# Altium schematic sheet ZIF_WRP.SchDoc
size B; DocumentNumber: 9; SheetNumber: 9; SheetTotal: 13
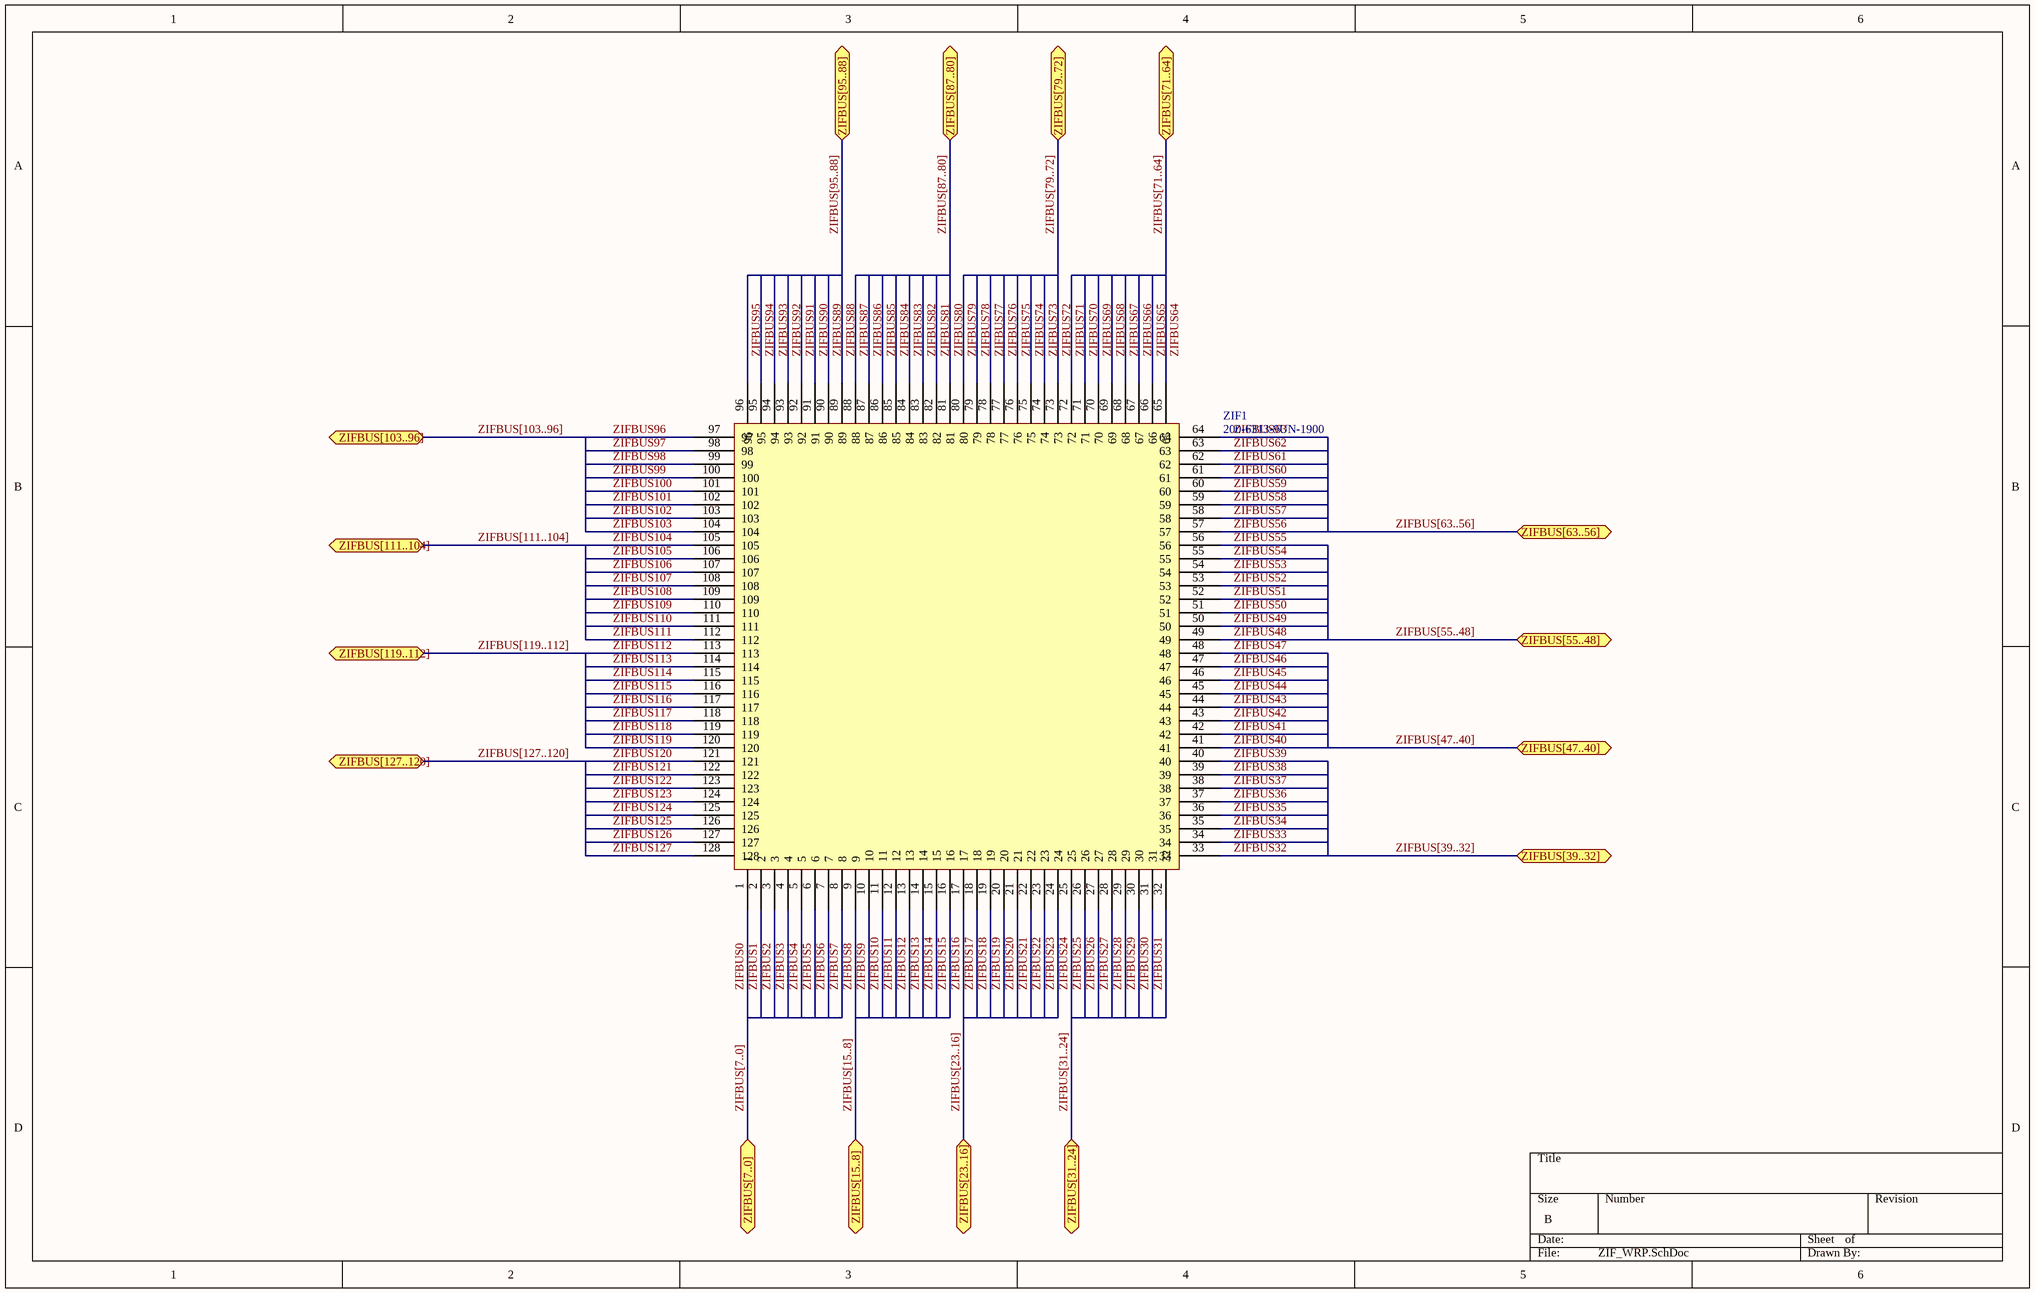
[diagram p0: ZIF_WRP.SchDoc]

## Parts
ZIF1  200-6313-9UN-1900  [ZIF_13x13]

## Ports
ZIFBUS[7..0], ZIFBUS[15..8], ZIFBUS[23..16], ZIFBUS[31..24], ZIFBUS[39..32], ZIFBUS[47..40], ZIFBUS[55..48], ZIFBUS[63..56], ZIFBUS[71..64], ZIFBUS[79..72], ZIFBUS[87..80], ZIFBUS[95..88], ZIFBUS[103..96], ZIFBUS[111..104], ZIFBUS[119..112], ZIFBUS[127..120]

## Nets
ZIFBUS0: ZIF1.1
ZIFBUS1: ZIF1.2
ZIFBUS2: ZIF1.3
ZIFBUS3: ZIF1.4
ZIFBUS4: ZIF1.5
ZIFBUS5: ZIF1.6
ZIFBUS6: ZIF1.7
ZIFBUS7: ZIF1.8
ZIFBUS8: ZIF1.9
ZIFBUS9: ZIF1.10
ZIFBUS10: ZIF1.11
ZIFBUS11: ZIF1.12
ZIFBUS12: ZIF1.13
ZIFBUS13: ZIF1.14
ZIFBUS14: ZIF1.15
ZIFBUS15: ZIF1.16
ZIFBUS16: ZIF1.17
ZIFBUS17: ZIF1.18
ZIFBUS18: ZIF1.19
ZIFBUS19: ZIF1.20
ZIFBUS20: ZIF1.21
ZIFBUS21: ZIF1.22
ZIFBUS22: ZIF1.23
ZIFBUS23: ZIF1.24
ZIFBUS24: ZIF1.25
ZIFBUS25: ZIF1.26
ZIFBUS26: ZIF1.27
ZIFBUS27: ZIF1.28
ZIFBUS28: ZIF1.29
ZIFBUS29: ZIF1.30
ZIFBUS30: ZIF1.31
ZIFBUS31: ZIF1.32
ZIFBUS32: ZIF1.33
ZIFBUS33: ZIF1.34
ZIFBUS34: ZIF1.35
ZIFBUS35: ZIF1.36
ZIFBUS36: ZIF1.37
ZIFBUS37: ZIF1.38
ZIFBUS38: ZIF1.39
ZIFBUS39: ZIF1.40
ZIFBUS40: ZIF1.41
ZIFBUS41: ZIF1.42
ZIFBUS42: ZIF1.43
ZIFBUS43: ZIF1.44
ZIFBUS44: ZIF1.45
ZIFBUS45: ZIF1.46
ZIFBUS46: ZIF1.47
ZIFBUS47: ZIF1.48
ZIFBUS48: ZIF1.49
ZIFBUS49: ZIF1.50
ZIFBUS50: ZIF1.51
ZIFBUS51: ZIF1.52
ZIFBUS52: ZIF1.53
ZIFBUS53: ZIF1.54
ZIFBUS54: ZIF1.55
ZIFBUS55: ZIF1.56
ZIFBUS56: ZIF1.57
ZIFBUS57: ZIF1.58
ZIFBUS58: ZIF1.59
ZIFBUS59: ZIF1.60
ZIFBUS60: ZIF1.61
ZIFBUS61: ZIF1.62
ZIFBUS62: ZIF1.63
ZIFBUS63: ZIF1.64
ZIFBUS64: ZIF1.65
ZIFBUS65: ZIF1.66
ZIFBUS66: ZIF1.67
ZIFBUS67: ZIF1.68
ZIFBUS68: ZIF1.69
ZIFBUS69: ZIF1.70
ZIFBUS70: ZIF1.71
ZIFBUS71: ZIF1.72
ZIFBUS72: ZIF1.73
ZIFBUS73: ZIF1.74
ZIFBUS74: ZIF1.75
ZIFBUS75: ZIF1.76
ZIFBUS76: ZIF1.77
ZIFBUS77: ZIF1.78
ZIFBUS78: ZIF1.79
ZIFBUS79: ZIF1.80
ZIFBUS80: ZIF1.81
ZIFBUS81: ZIF1.82
ZIFBUS82: ZIF1.83
ZIFBUS83: ZIF1.84
ZIFBUS84: ZIF1.85
ZIFBUS85: ZIF1.86
ZIFBUS86: ZIF1.87
ZIFBUS87: ZIF1.88
ZIFBUS88: ZIF1.89
ZIFBUS89: ZIF1.90
ZIFBUS90: ZIF1.91
ZIFBUS91: ZIF1.92
ZIFBUS92: ZIF1.93
ZIFBUS93: ZIF1.94
ZIFBUS94: ZIF1.95
ZIFBUS95: ZIF1.96
ZIFBUS96: ZIF1.97
ZIFBUS97: ZIF1.98
ZIFBUS98: ZIF1.99
ZIFBUS99: ZIF1.100
ZIFBUS100: ZIF1.101
ZIFBUS101: ZIF1.102
ZIFBUS102: ZIF1.103
ZIFBUS103: ZIF1.104
ZIFBUS104: ZIF1.105
ZIFBUS105: ZIF1.106
ZIFBUS106: ZIF1.107
ZIFBUS107: ZIF1.108
ZIFBUS108: ZIF1.109
ZIFBUS109: ZIF1.110
ZIFBUS110: ZIF1.111
ZIFBUS111: ZIF1.112
ZIFBUS112: ZIF1.113
ZIFBUS113: ZIF1.114
ZIFBUS114: ZIF1.115
ZIFBUS115: ZIF1.116
ZIFBUS116: ZIF1.117
ZIFBUS117: ZIF1.118
ZIFBUS118: ZIF1.119
ZIFBUS119: ZIF1.120
ZIFBUS120: ZIF1.121
ZIFBUS121: ZIF1.122
ZIFBUS122: ZIF1.123
ZIFBUS123: ZIF1.124
ZIFBUS124: ZIF1.125
ZIFBUS125: ZIF1.126
ZIFBUS126: ZIF1.127
ZIFBUS127: ZIF1.128

## Buses and harness runs
bus ZIFBUS[7..0] = port ZIFBUS[7..0]
bus ZIFBUS[15..8] = port ZIFBUS[15..8]
bus ZIFBUS[23..16] = port ZIFBUS[23..16]
bus ZIFBUS[31..24] = port ZIFBUS[31..24]
bus ZIFBUS[39..32] = port ZIFBUS[39..32]
bus ZIFBUS[47..40] = port ZIFBUS[47..40]
bus ZIFBUS[55..48] = port ZIFBUS[55..48]
bus ZIFBUS[63..56] = port ZIFBUS[63..56]
bus ZIFBUS[71..64] = port ZIFBUS[71..64]
bus ZIFBUS[79..72] = port ZIFBUS[79..72]
bus ZIFBUS[87..80] = port ZIFBUS[87..80]
bus ZIFBUS[95..88] = port ZIFBUS[95..88]
bus ZIFBUS[103..96] = port ZIFBUS[103..96]
bus ZIFBUS[111..104] = port ZIFBUS[111..104]
bus ZIFBUS[119..112] = port ZIFBUS[119..112]
bus ZIFBUS[127..120] = port ZIFBUS[127..120]

## Library data of the parts
ZIF1 = 200-6313-9UN-1900: CONN SOCKET PGA ZIF 169POS GOLD; Manufacturer: 3M; Number of Positions or Pins (Grid): 169 (13 x 13); Pitch - Mating: 0.100" (2.54mm); Material Flammability Rating: UL94 V-0; Current Rating: 1A; Supplier 1: Digi-Key; Manufacturer Part Number: 200-6313-9UN-1900; RoHS: RoHS Compliant; Category: Connectors, Interconnects; Stock 1: 80; Pricing 1: 1=44.25, 10=41.648, 25=40.3464, 50=37.7436, 100=35.6611, 250=34.61992, 500=33.839 (USD); Packaging: Bulk; Type: PGA, ZIF (ZIP); Contact Finish - Mating: Gold; Contact Finish Thickness - Mating: 30µin (0.76µm); Contact Material - Mating: Beryllium Copper; Mounting Type: Through Hole; Features: -; Termination: Solder; Pitch - Post: 0.100" (2.54mm); Contact Finish - Post: Gold; Contact Finish Thickness - Post: 30µin (0.76µm); Contact Material - Post: Beryllium Copper; Housing Material: Polyethersulfone (PES); Operating Temperature: -55°C ~ 150°C; Termination Post Length: 0.130" (3.30mm); Contact Resistance: -; ComponentLink1URL: http://multimedia.3m.com/mws/mediawebserver?66666UuZjcFSLXTtlX&cMXMXEVuQEcuZgVs6EVs6E666666--; ComponentLink1Description: http://multimedia.3m.com/mws/mediawebserver?66666UuZjcFSLXTtlX&cMXMXEVuQEcuZgVs6EVs6E666666--